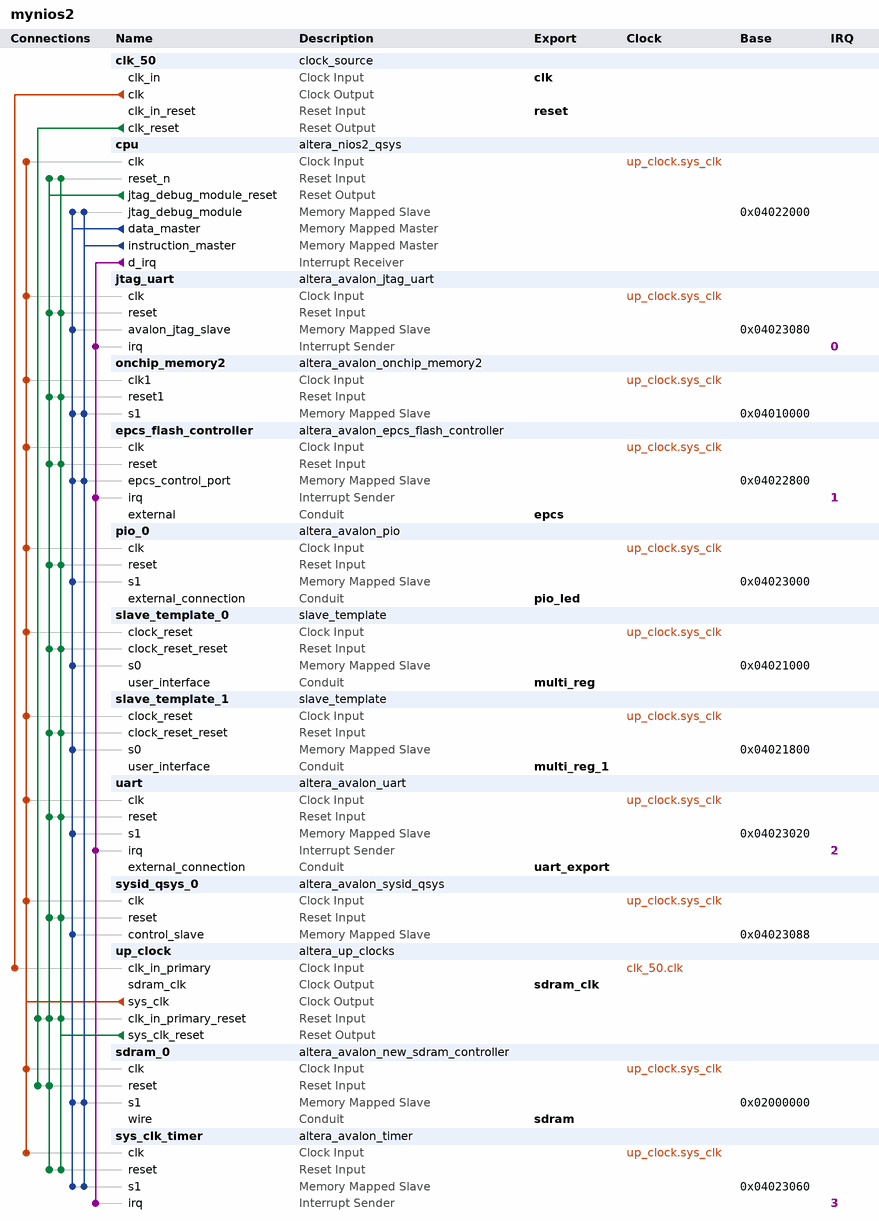
[diagram p0: system contents]
# Platform Designer (Qsys) system mynios2
# Parameters at their usual value, and those the tool derives, are not listed.
package require -exact qsys 11.0
create_system mynios2
set_project_property DEVICE_FAMILY CYCLONEIVE

add_instance clk_50 clock_source 11.0
set_instance_parameter_value clk_50 clockFrequency 50000000

add_instance cpu altera_nios2_qsys 11.0
set_instance_parameter_value cpu manuallyAssignCpuID false
set_instance_parameter_value cpu resetSlave epcs_flash_controller.epcs_control_port
set_instance_parameter_value cpu exceptionSlave onchip_memory2.s1
set_instance_parameter_value cpu breakSlave cpu.jtag_debug_module
set_instance_parameter_value cpu impl Tiny
set_instance_parameter_value cpu icache_size 4096

add_instance jtag_uart altera_avalon_jtag_uart 11.0
set_instance_parameter_value jtag_uart simInteractiveOptions INTERACTIVE_ASCII_OUTPUT

add_instance onchip_memory2 altera_avalon_onchip_memory2 11.0
set_instance_parameter_value onchip_memory2 dataWidth 32
set_instance_parameter_value onchip_memory2 dualPort false
set_instance_parameter_value onchip_memory2 initMemContent true
set_instance_parameter_value onchip_memory2 initializationFileName onchip_memory2
set_instance_parameter_value onchip_memory2 memorySize 45000

add_instance epcs_flash_controller altera_avalon_epcs_flash_controller 11.0

add_instance pio_0 altera_avalon_pio 11.0
set_instance_parameter_value pio_0 bitModifyingOutReg true
set_instance_parameter_value pio_0 direction Output
set_instance_parameter_value pio_0 width 16

add_instance slave_template_0 slave_template 2.0
set_instance_parameter_value slave_template_0 DATA_WIDTH 32
set_instance_parameter_value slave_template_0 ENABLE_SYNC_SIGNALS 0
set_instance_parameter_value slave_template_0 MODE_0 2
set_instance_parameter_value slave_template_0 MODE_1 2
set_instance_parameter_value slave_template_0 MODE_2 2
set_instance_parameter_value slave_template_0 MODE_3 2
set_instance_parameter_value slave_template_0 MODE_4 2
set_instance_parameter_value slave_template_0 MODE_5 2
set_instance_parameter_value slave_template_0 MODE_6 2
set_instance_parameter_value slave_template_0 MODE_7 2
set_instance_parameter_value slave_template_0 MODE_8 2
set_instance_parameter_value slave_template_0 MODE_9 2
set_instance_parameter_value slave_template_0 MODE_10 2
set_instance_parameter_value slave_template_0 MODE_11 2
set_instance_parameter_value slave_template_0 MODE_12 2
set_instance_parameter_value slave_template_0 MODE_13 2
set_instance_parameter_value slave_template_0 MODE_14 2
set_instance_parameter_value slave_template_0 MODE_15 2
set_instance_parameter_value slave_template_0 IRQ_EN 0

add_instance slave_template_1 slave_template 2.0
set_instance_parameter_value slave_template_1 DATA_WIDTH 32
set_instance_parameter_value slave_template_1 ENABLE_SYNC_SIGNALS 0
set_instance_parameter_value slave_template_1 MODE_0 2
set_instance_parameter_value slave_template_1 MODE_1 2
set_instance_parameter_value slave_template_1 MODE_2 2
set_instance_parameter_value slave_template_1 MODE_3 2
set_instance_parameter_value slave_template_1 MODE_4 2
set_instance_parameter_value slave_template_1 MODE_5 2
set_instance_parameter_value slave_template_1 MODE_6 2
set_instance_parameter_value slave_template_1 MODE_7 2
set_instance_parameter_value slave_template_1 MODE_8 2
set_instance_parameter_value slave_template_1 MODE_9 2
set_instance_parameter_value slave_template_1 MODE_10 2
set_instance_parameter_value slave_template_1 MODE_11 2
set_instance_parameter_value slave_template_1 MODE_12 2
set_instance_parameter_value slave_template_1 MODE_13 2
set_instance_parameter_value slave_template_1 MODE_14 2
set_instance_parameter_value slave_template_1 MODE_15 2
set_instance_parameter_value slave_template_1 IRQ_EN 0

add_instance uart altera_avalon_uart 11.0
set_instance_parameter_value uart baud 19200
set_instance_parameter_value uart dataBits 8
set_instance_parameter_value uart fixedBaud true
set_instance_parameter_value uart parity NONE
set_instance_parameter_value uart stopBits 1

add_instance sysid_qsys_0 altera_avalon_sysid_qsys 11.0
set_instance_parameter_value sysid_qsys_0 id 12345678

add_instance up_clock altera_up_clocks 13.0
set_instance_parameter_value up_clock board DE0-Nano
set_instance_parameter_value up_clock vga_clk false
set_instance_parameter_value up_clock audio_clk true
set_instance_parameter_value up_clock audio_clk_freq 12.288

add_instance sdram_0 altera_avalon_new_sdram_controller 11.0
set_instance_parameter_value sdram_0 TAC 5.5
set_instance_parameter_value sdram_0 TRCD 20.0
set_instance_parameter_value sdram_0 TRP 20.0
set_instance_parameter_value sdram_0 casLatency 3
set_instance_parameter_value sdram_0 columnWidth 9
set_instance_parameter_value sdram_0 dataWidth 16
set_instance_parameter_value sdram_0 generateSimulationModel false
set_instance_parameter_value sdram_0 model custom
set_instance_parameter_value sdram_0 numberOfBanks 4
set_instance_parameter_value sdram_0 numberOfChipSelects 1
set_instance_parameter_value sdram_0 powerUpDelay 100.0
set_instance_parameter_value sdram_0 refreshPeriod 15.625
set_instance_parameter_value sdram_0 rowWidth 13

add_instance sys_clk_timer altera_avalon_timer 11.0
set_instance_parameter_value sys_clk_timer period 1
set_instance_parameter_value sys_clk_timer periodUnits MSEC
set_instance_parameter_value sys_clk_timer timerPreset CUSTOM

# connections
add_connection clk_50.clk up_clock.clk_in_primary clock
add_connection up_clock.sys_clk cpu.clk clock
add_connection up_clock.sys_clk epcs_flash_controller.clk clock
add_connection up_clock.sys_clk jtag_uart.clk clock
add_connection up_clock.sys_clk onchip_memory2.clk1 clock
add_connection up_clock.sys_clk pio_0.clk clock
add_connection up_clock.sys_clk sdram_0.clk clock
add_connection up_clock.sys_clk slave_template_0.clock_reset clock
add_connection up_clock.sys_clk slave_template_1.clock_reset clock
add_connection up_clock.sys_clk sys_clk_timer.clk clock
add_connection up_clock.sys_clk sysid_qsys_0.clk clock
add_connection up_clock.sys_clk uart.clk clock
add_connection clk_50.clk_reset sdram_0.reset reset
add_connection clk_50.clk_reset up_clock.clk_in_primary_reset reset
add_connection cpu.jtag_debug_module_reset cpu.reset_n reset
add_connection cpu.jtag_debug_module_reset epcs_flash_controller.reset reset
add_connection cpu.jtag_debug_module_reset jtag_uart.reset reset
add_connection cpu.jtag_debug_module_reset onchip_memory2.reset1 reset
add_connection cpu.jtag_debug_module_reset pio_0.reset reset
add_connection cpu.jtag_debug_module_reset sdram_0.reset reset
add_connection cpu.jtag_debug_module_reset slave_template_0.clock_reset_reset reset
add_connection cpu.jtag_debug_module_reset slave_template_1.clock_reset_reset reset
add_connection cpu.jtag_debug_module_reset sys_clk_timer.reset reset
add_connection cpu.jtag_debug_module_reset sysid_qsys_0.reset reset
add_connection cpu.jtag_debug_module_reset uart.reset reset
add_connection cpu.jtag_debug_module_reset up_clock.clk_in_primary_reset reset
add_connection up_clock.sys_clk_reset cpu.reset_n reset
add_connection up_clock.sys_clk_reset epcs_flash_controller.reset reset
add_connection up_clock.sys_clk_reset jtag_uart.reset reset
add_connection up_clock.sys_clk_reset onchip_memory2.reset1 reset
add_connection up_clock.sys_clk_reset pio_0.reset reset
add_connection up_clock.sys_clk_reset slave_template_0.clock_reset_reset reset
add_connection up_clock.sys_clk_reset slave_template_1.clock_reset_reset reset
add_connection up_clock.sys_clk_reset sys_clk_timer.reset reset
add_connection up_clock.sys_clk_reset sysid_qsys_0.reset reset
add_connection up_clock.sys_clk_reset uart.reset reset
add_connection up_clock.sys_clk_reset up_clock.clk_in_primary_reset reset
add_connection cpu.data_master cpu.jtag_debug_module avalon
set_connection_parameter_value cpu.data_master/cpu.jtag_debug_module baseAddress 0x04022000
add_connection cpu.data_master epcs_flash_controller.epcs_control_port avalon
set_connection_parameter_value cpu.data_master/epcs_flash_controller.epcs_control_port baseAddress 0x04022800
add_connection cpu.data_master jtag_uart.avalon_jtag_slave avalon
set_connection_parameter_value cpu.data_master/jtag_uart.avalon_jtag_slave baseAddress 0x04023080
add_connection cpu.data_master onchip_memory2.s1 avalon
set_connection_parameter_value cpu.data_master/onchip_memory2.s1 baseAddress 0x04010000
add_connection cpu.data_master pio_0.s1 avalon
set_connection_parameter_value cpu.data_master/pio_0.s1 baseAddress 0x04023000
add_connection cpu.data_master sdram_0.s1 avalon
set_connection_parameter_value cpu.data_master/sdram_0.s1 baseAddress 0x02000000
add_connection cpu.data_master slave_template_0.s0 avalon
set_connection_parameter_value cpu.data_master/slave_template_0.s0 baseAddress 0x04021000
add_connection cpu.data_master slave_template_1.s0 avalon
set_connection_parameter_value cpu.data_master/slave_template_1.s0 baseAddress 0x04021800
add_connection cpu.data_master sys_clk_timer.s1 avalon
set_connection_parameter_value cpu.data_master/sys_clk_timer.s1 baseAddress 0x04023060
add_connection cpu.data_master sysid_qsys_0.control_slave avalon
set_connection_parameter_value cpu.data_master/sysid_qsys_0.control_slave baseAddress 0x04023088
add_connection cpu.data_master uart.s1 avalon
set_connection_parameter_value cpu.data_master/uart.s1 baseAddress 0x04023020
add_connection cpu.instruction_master cpu.jtag_debug_module avalon
set_connection_parameter_value cpu.instruction_master/cpu.jtag_debug_module baseAddress 0x04022000
add_connection cpu.instruction_master epcs_flash_controller.epcs_control_port avalon
set_connection_parameter_value cpu.instruction_master/epcs_flash_controller.epcs_control_port baseAddress 0x04022800
add_connection cpu.instruction_master onchip_memory2.s1 avalon
set_connection_parameter_value cpu.instruction_master/onchip_memory2.s1 baseAddress 0x04010000
add_connection cpu.instruction_master sdram_0.s1 avalon
set_connection_parameter_value cpu.instruction_master/sdram_0.s1 baseAddress 0x02000000
add_connection cpu.instruction_master sys_clk_timer.s1 avalon
set_connection_parameter_value cpu.instruction_master/sys_clk_timer.s1 baseAddress 0x04023060
add_connection cpu.d_irq epcs_flash_controller.irq interrupt
set_connection_parameter_value cpu.d_irq/epcs_flash_controller.irq irqNumber 1
add_connection cpu.d_irq jtag_uart.irq interrupt
set_connection_parameter_value cpu.d_irq/jtag_uart.irq irqNumber 0
add_connection cpu.d_irq sys_clk_timer.irq interrupt
set_connection_parameter_value cpu.d_irq/sys_clk_timer.irq irqNumber 3
add_connection cpu.d_irq uart.irq interrupt
set_connection_parameter_value cpu.d_irq/uart.irq irqNumber 2

# exported interfaces
add_interface clk clock sink
set_interface_property clk EXPORT_OF clk_50.clk_in
add_interface reset reset sink
set_interface_property reset EXPORT_OF clk_50.clk_in_reset
add_interface epcs conduit end
set_interface_property epcs EXPORT_OF epcs_flash_controller.external
add_interface pio_led conduit end
set_interface_property pio_led EXPORT_OF pio_0.external_connection
add_interface multi_reg conduit end
set_interface_property multi_reg EXPORT_OF slave_template_0.user_interface
add_interface uart_export conduit end
set_interface_property uart_export EXPORT_OF uart.external_connection
add_interface multi_reg_1 conduit end
set_interface_property multi_reg_1 EXPORT_OF slave_template_1.user_interface
add_interface sdram_clk clock source
set_interface_property sdram_clk EXPORT_OF up_clock.sdram_clk
add_interface sdram conduit end
set_interface_property sdram EXPORT_OF sdram_0.wire

save_system mynios2.qsys
